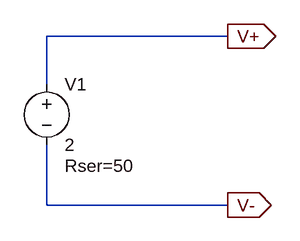
[diagram p0: schematic FGen.asc]
FGen.asc, the LTspice schematic file:
Version 4
SHEET 1 880 680
WIRE 368 80 128 80
WIRE 128 144 128 80
WIRE 128 304 128 224
WIRE 368 304 128 304
FLAG 368 80 V+
IOPIN 368 80 Out
FLAG 368 304 V-
IOPIN 368 304 Out
SYMBOL voltage 128 128 R0
WINDOW 123 0 0 Left 0
WINDOW 39 24 124 Left 2
SYMATTR InstName V1
SYMATTR Value 2
SYMATTR SpiceLine Rser=50

The netlist it stands for:
* FGen.asc
V1 V+ V- 2 Rser=50
.backanno
.end